# EAGLE design 2019_Dashboard_1-29-19 (EAGLE 9.1.0)
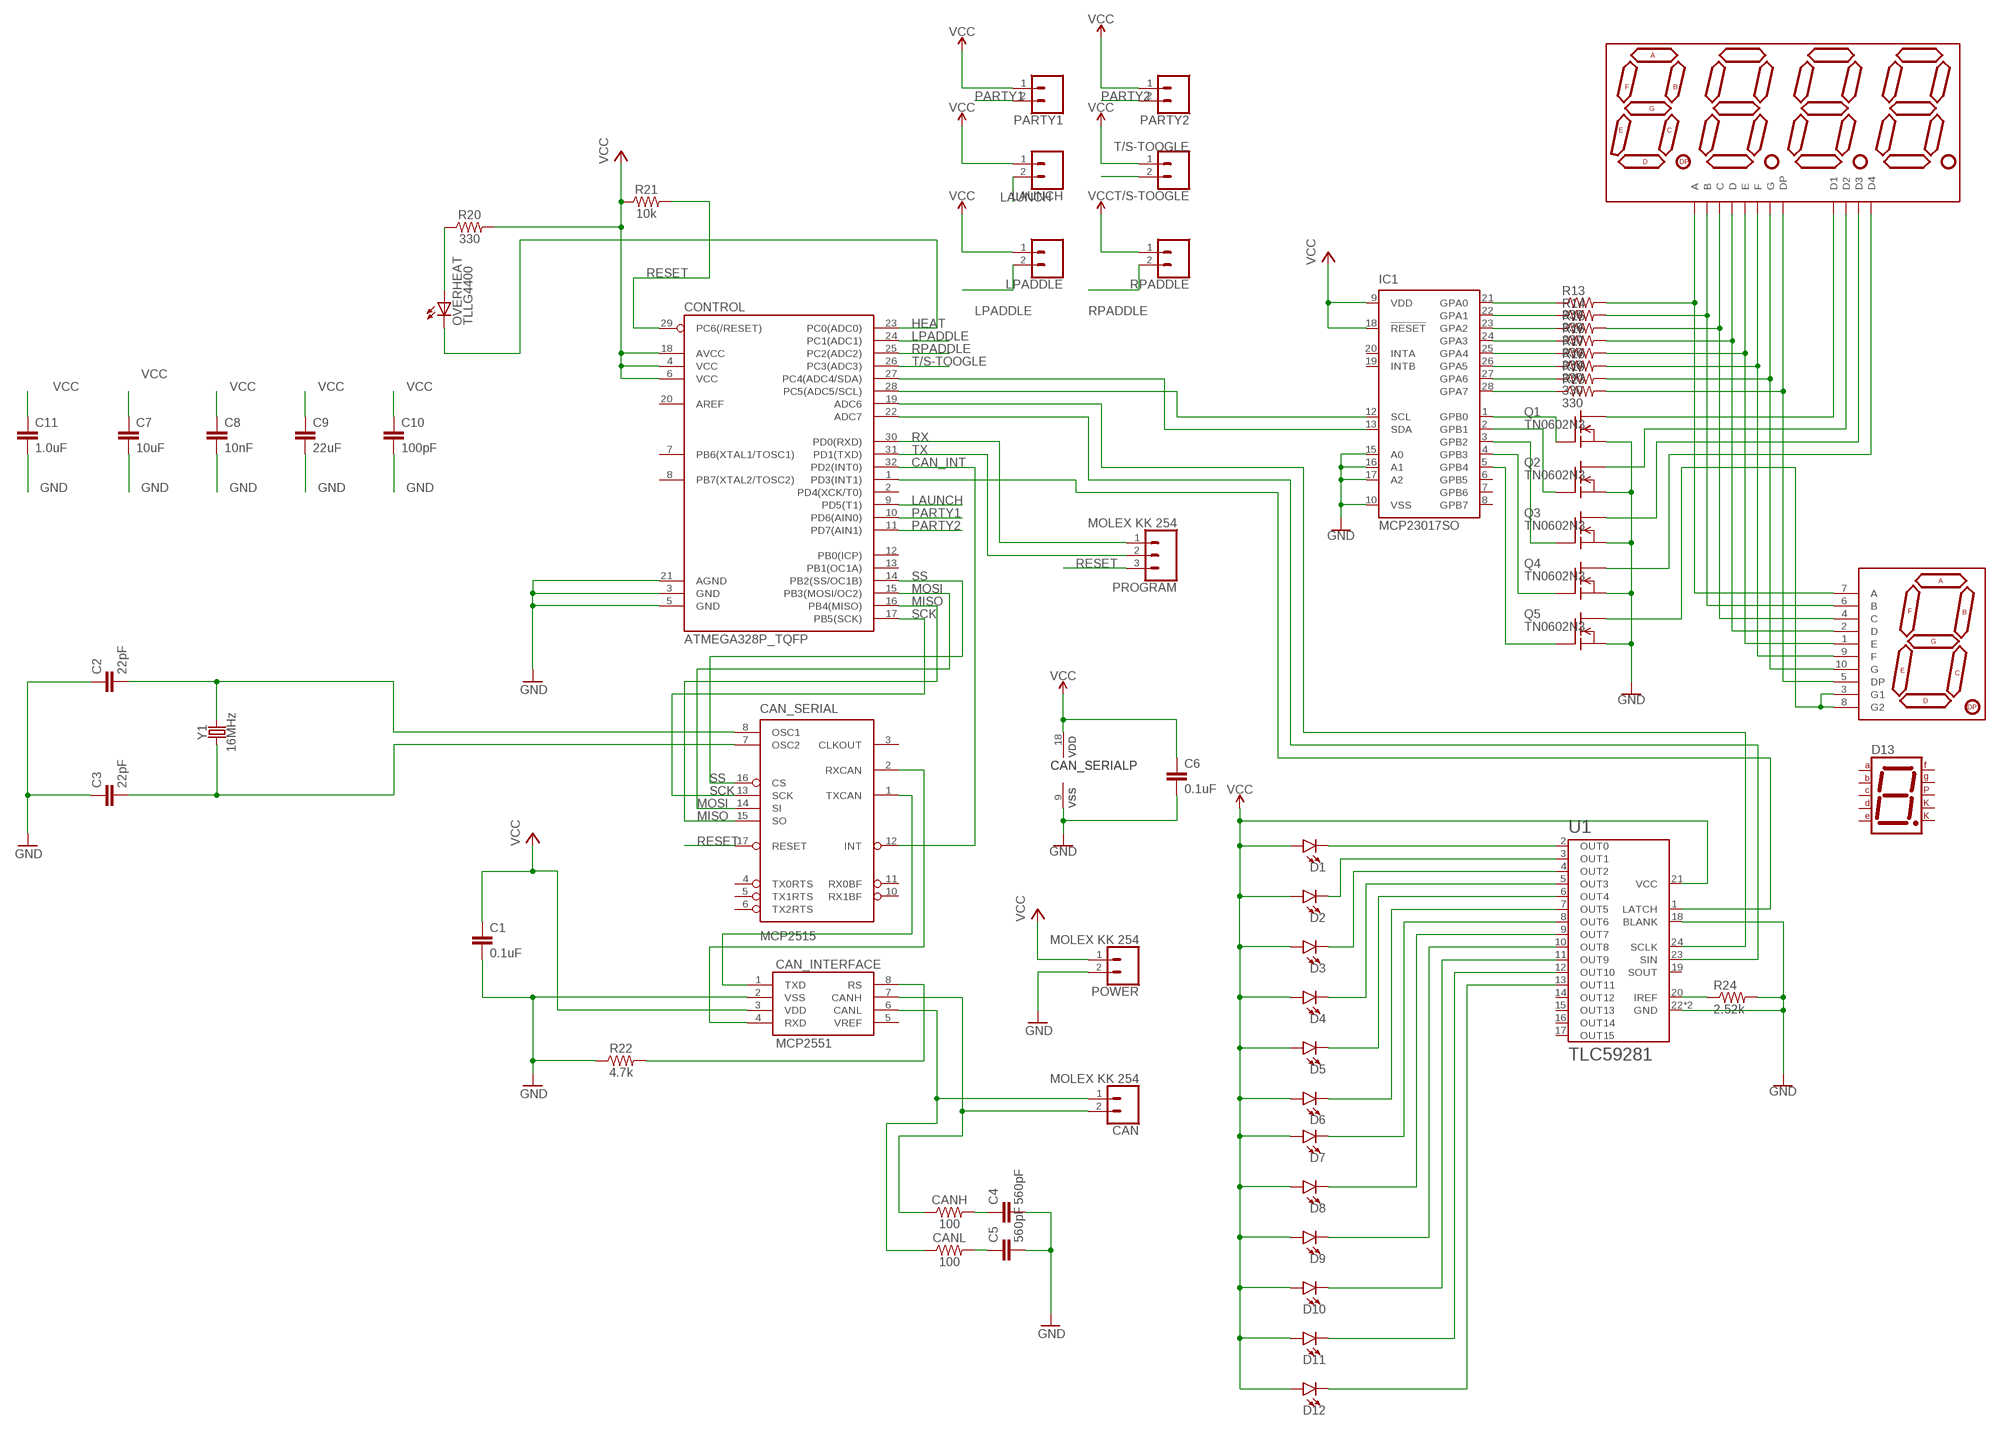
[diagram p0: schematic, sheet 1]

## Parts
C1  0.1uF  0.1UF-0603-25V-(+80/-20%)  [0603]
C2  22pF  22PF-0603-50V-5%  [0603]
C3  22pF  22PF-0603-50V-5%  [0603]
C4  560pF  560PF-0603-50V-5%  [0603]
C5  560pF  560PF-0603-50V-5%  [0603]
C6  0.1uF  0.1UF-0402-16V-10%  [0402]
C7  10uF  10UF-0805-10V-10%  [0805]
C8  10nF  10NF-0603-50V-10%  [0603]
C9  22uF  22UF-0805-6.3V-20%  [0805]
C10  100pF  100PF-0603-50V-5%  [0603]
C11  1.0uF  1.0UF-0805-25V-(+80/-20%)  [0805]
CAN  MOLEX KK 254  CONN_02  [1X02]
CAN_INTERFACE  MCP2551  [SO08]
CAN_SERIAL  MCP2515  MCP2515(MCP2510)SO  [SO18W]
CANH  100  100OHM-0603-1/4W-5%  [0603]
CANL  100  100OHM-0603-1/4W-5%  [0603]
CONTROL  ATMEGA328P_TQFP  [TQFP32-08]
D1  LED5MM  [LED_5MM]
D2  LED5MM  [LED_5MM]
D3  LED5MM  [LED_5MM]
D4  LED5MM  [LED_5MM]
D5  LED5MM  [LED_5MM]
D6  LED5MM  [LED_5MM]
D7  LED5MM  [LED_5MM]
D8  LED5MM  [LED_5MM]
D9  LED5MM  [LED_5MM]
D10  LED5MM  [LED_5MM]
D11  LED5MM  [LED_5MM]
D12  LED5MM  [LED_5MM]
D13  7SEG-CK  [7SEG-13]
DISP1  ATA8041ARBJ  7-SEGMENT-4DIGIT-20MM-RED  [7-SEGMENT-4DIGIT-20MM]
IC1  MCP23017SO  [SO28W]
LAUNCH  CONN_02LOCK  [1X02_LOCK]
LPADDLE  CONN_02LOCK  [1X02_LOCK]
OVERHEAT  TLLG4400  [LED3MM]
PARTY1  CONN_02LOCK  [1X02_LOCK]
PARTY2  CONN_02LOCK  [1X02_LOCK]
POWER  MOLEX KK 254  CONN_02  [1X02]
PROGRAM  MOLEX KK 254  CONN_03  [1X03]
Q1  TN0602N3  [TO-92]
Q2  TN0602N3  [TO-92]
Q3  TN0602N3  [TO-92]
Q4  TN0602N3  [TO-92]
Q5  TN0602N3  [TO-92]
R13  330  R-US_R0603  [R0603]
R14  330  R-US_R0603  [R0603]
R15  330  R-US_R0603  [R0603]
R16  330  R-US_R0603  [R0603]
R17  330  R-US_R0603  [R0603]
R18  330  R-US_R0603  [R0603]
R19  330  R-US_R0603  [R0603]
R20  330  330OHM-0603-1/10W-1%  [0603]
R21  10k  10KOHM-0603-1/10W-1%  [0603]
R22  4.7k  4.7KOHM-0603-1/10W-1%  [0603]
R23  330  R-US_R0603  [R0603]
R24  2.52k  R-US_R0603  [R0603]
RPADDLE  CONN_02LOCK  [1X02_LOCK]
T/S-TOOGLE  CONN_02LOCK  [1X02_LOCK]
U1  TLC59281  [QFN-24]
U$1  YSD-1601AR4B-8  7-SEGMENT-1DIGIT-1INCH-RED  [7-SEGMENT-1"PTH]
Y1  16MHz  CRYSTAL-16MHZPTH-HC49US  [HC49US]

## Nets
CAN_INT: CAN_SERIAL.12(INT) CONTROL.32(PD2(INT0))
CANH: CAN.2 CAN_INTERFACE.7(CANH) CANH.1
CANL: CAN.1 CAN_INTERFACE.6(CANL) CANL.1
CHI: C4.1 CANH.2
CI_SLOPE: CAN_INTERFACE.8(RS) R22.2
CLI: C5.1 CANL.2
GND [power]: C1.2 C2.1 C3.1 C4.2 C5.2 C6.2 C7.2 C8.2 C9.2 C10.2 C11.2 CAN_INTERFACE.2(VSS) CAN_SERIAL.9(VSS) CONTROL.3(GND) CONTROL.5(GND) CONTROL.21(AGND) IC1.10(VSS) IC1.15(A0) IC1.16(A1) IC1.17(A2) POWER.2 Q1.1(S) Q2.1(S) Q3.1(S) Q4.1(S) Q5.1(S) R22.1 R24.2 U1.18(BLANK) U1.22(GND) U1.EP(GND)
HEAT: CONTROL.23(PC0(ADC0)) OVERHEAT.K(C)
HEAT+: OVERHEAT.A R20.1
LAUNCH: CONTROL.9(PD5(T1)) LAUNCH.2
LPADDLE: CONTROL.24(PC1(ADC1)) LPADDLE.2
MISO: CAN_SERIAL.15(SO) CONTROL.16(PB4(MISO))
MOSI: CAN_SERIAL.14(SI) CONTROL.15(PB3(MOSI/OC2))
N$1: CONTROL.28(PC5(ADC5/SCL)) IC1.12(SCL)
N$2: CONTROL.27(PC4(ADC4/SDA)) IC1.13(SDA)
N$3 [led]: DISP1.11(A) R13.2 U$1.7(A)
N$4 [led]: DISP1.7(B) R14.2 U$1.6(B)
N$5 [led]: DISP1.4(C) R15.2 U$1.4(C)
N$6 [led]: DISP1.2(D) R16.2 U$1.2(D)
N$7 [led]: DISP1.1(E) R17.2 U$1.1(E)
N$8 [led]: DISP1.10(F) R18.2 U$1.9(F)
N$9 [led]: DISP1.5(G) R19.2 U$1.10(G)
N$10 [led]: DISP1.3(DP) R23.2 U$1.5(DP)
N$11 [led]: DISP1.12(D1) Q1.3(D)
N$12 [led]: DISP1.9(D2) Q2.3(D)
N$13 [led]: DISP1.8(D3) Q3.3(D)
N$14 [led]: DISP1.6(D4) Q4.3(D)
N$15 [led]: Q5.3(D) U$1.3(G1) U$1.8(G2)
N$18: CONTROL.19(ADC6) U1.24(SCLK)
N$19: CONTROL.22(ADC7) U1.23(SIN)
N$20: CONTROL.1(PD3(INT1)) U1.1(LATCH)
N$28: IC1.21(GPA0) R13.1
N$29: IC1.22(GPA1) R14.1
N$30: IC1.23(GPA2) R15.1
N$31: IC1.24(GPA3) R16.1
N$32: IC1.25(GPA4) R17.1
N$33: IC1.26(GPA5) R18.1
N$46: IC1.27(GPA6) R19.1
N$47: IC1.28(GPA7) R23.1
N$48: IC1.1(GPB0) Q1.2(G)
N$49: IC1.2(GPB1) Q2.2(G)
N$50: IC1.3(GPB2) Q3.2(G)
N$51: IC1.4(GPB3) Q4.2(G)
N$52: IC1.5(GPB4) Q5.2(G)
N$53: D1.K(C) U1.2(OUT0)
N$54: D2.K(C) U1.3(OUT1)
N$55: D3.K(C) U1.4(OUT2)
N$56: D4.K(C) U1.5(OUT3)
N$57: CAN_INTERFACE.1(TXD) CAN_SERIAL.1(TXCAN)
N$58: CAN_INTERFACE.4(RXD) CAN_SERIAL.2(RXCAN)
N$59: D5.K(C) U1.6(OUT4)
N$60: D6.K(C) U1.7(OUT5)
N$61: D7.K(C) U1.8(OUT6)
N$62: D8.K(C) U1.9(OUT7)
N$63: D9.K(C) U1.10(OUT8)
N$64: D10.K(C) U1.11(OUT9)
N$65: D11.K(C) U1.12(OUT10)
N$66: D12.K(C) U1.13(OUT11)
N$67: R24.1 U1.20(IREF)
OSC1: C2.2 CAN_SERIAL.8(OSC1) Y1.2
OSC2: C3.2 CAN_SERIAL.7(OSC2) Y1.1
PARTY1: CONTROL.10(PD6(AIN0)) PARTY1.2
PARTY2: CONTROL.11(PD7(AIN1)) PARTY2.2
RESET: CAN_SERIAL.17(RESET) CONTROL.29(PC6(/RESET)) PROGRAM.3 R21.2
RPADDLE: CONTROL.25(PC2(ADC2)) RPADDLE.2
RX: CONTROL.30(PD0(RXD)) PROGRAM.1
SCK: CAN_SERIAL.13(SCK) CONTROL.17(PB5(SCK))
SS: CAN_SERIAL.16(CS) CONTROL.14(PB2(SS/OC1B))
T/S-TOOGLE: CONTROL.26(PC3(ADC3)) T/S-TOOGLE.2
TX: CONTROL.31(PD1(TXD)) PROGRAM.2
VCC [power]: C1.1 C6.1 C7.1 C8.1 C9.1 C10.1 C11.1 CAN_INTERFACE.3(VDD) CAN_SERIAL.18(VDD) CONTROL.4(VCC) CONTROL.6(VCC) CONTROL.18(AVCC) D1.A D2.A D3.A D4.A D5.A D6.A D7.A D8.A D9.A D10.A D11.A D12.A IC1.9(VDD) IC1.18(!RESET) LAUNCH.1 LPADDLE.1 PARTY1.1 PARTY2.1 POWER.1 R20.2 R21.1 RPADDLE.1 T/S-TOOGLE.1 U1.21(VCC)
Unconnected: CAN_INTERFACE.5(VREF) CAN_SERIAL.3(CLKOUT) CAN_SERIAL.4(TX0RTS) CAN_SERIAL.5(TX1RTS) CAN_SERIAL.6(TX2RTS) CAN_SERIAL.10(RX1BF) CAN_SERIAL.11(RX0BF) CONTROL.2(PD4(XCK/T0)) CONTROL.7(PB6(XTAL1/TOSC1)) CONTROL.8(PB7(XTAL2/TOSC2)) CONTROL.12(PB0(ICP)) CONTROL.13(PB1(OC1A)) CONTROL.20(AREF) D13.1(E) D13.2(D) D13.3(CK1) D13.4(C) D13.5(DP) D13.6(B) D13.7(A) D13.8(CK2) D13.9(F) D13.10(G) IC1.6(GPB5) IC1.7(GPB6) IC1.8(GPB7) IC1.19(INTB) IC1.20(INTA) U1.14(OUT12) U1.15(OUT13) U1.16(OUT14) U1.17(OUT15) U1.19(SOUT)

## Library data of the parts
C1 = SparkFun-Capacitors:0.1UF: 0.1µF ceramic capacitors A capacitor is a passive two-terminal electrical component used to store electrical energy temporarily in an electric field.; PROD_ID: CAP-00810
C2 C3 = SparkFun-Capacitors:22PF: 22pF ceramic capacitors A capacitor is a passive two-terminal electrical component used to store electrical energy temporarily in an electric field.; PROD_ID: CAP-07876
C4 C5 = SparkFun-Capacitors:560PF: 0.56nF/560pF ceramic capacitors A capacitor is a passive two-terminal electrical component used to store electrical energy temporarily in an electric field.; PROD_ID: CAP-08749
C6 = SparkFun-Capacitors:0.1UF: 0.1µF ceramic capacitors A capacitor is a passive two-terminal electrical component used to store electrical energy temporarily in an electric field.; PROD_ID: CAP-12416
C7 = SparkFun-Capacitors:10UF: 10.0µF ceramic capacitors A capacitor is a passive two-terminal electrical component used to store electrical energy temporarily in an electric field.; PROD_ID: CAP-11330
C8 = SparkFun-Capacitors:10NF: 0.01uF/10nF/10,000pF ceramic capacitors A capacitor is a passive two-terminal electrical component used to store electrical energy temporarily in an electric field. CAP-09321; PROD_ID: CAP-00867
C9 = SparkFun-Capacitors:22UF: 22µF ceramic capacitors A capacitor is a passive two-terminal electrical component used to store electrical energy temporarily in an electric field.; PROD_ID: CAP-08402
C10 = SparkFun-Capacitors:100PF: 100pF/0.1nF ceramic capacitors A capacitor is a passive two-terminal electrical component used to store electrical energy temporarily in an electric field.; PROD_ID: CAP-07883
C11 = SparkFun-Capacitors:1.0UF: 1µF ceramic capacitors A capacitor is a passive two-terminal electrical component used to store electrical energy temporarily in an electric field.; PROD_ID: CAP-11625
CAN LAUNCH LPADDLE PARTY1 PARTY2 POWER RPADDLE T/S-TOOGLE = SparkFun-Connectors:CONN_02: Multi connection point. Often used as Generic Header-pin footprint for 0.1 inch spaced/style header connections On any of the 0.1 inch spaced packages, you can populate with these: Break Away Headers - Straight <https://www.sparkfun.com/products/116> (PRT-00116) Break Away Male Headers - Right Angle <https://www.sparkfun.com/products/553> (PRT-00553) Female Headers <https://www.sparkfun.com/products/115> (PRT-00115) Break Away Headers - Machine Pin <https://www.sparkfun.com/products/117> (PRT-00117) Break Away Female Headers - Swiss Machine Pin <https://www.sparkfun.com/products/743> (PRT-00743) For SCREWTERMINALS and SPRING TERMINALS visit here: Screw Terimnals on SparkFun.com <https://www.sparkfun.com/search/results?term=Screw+Terminals> (5mm/3.5mm/2.54mm spacing) This device is also useful as a general connection point to wire up your design to another part of your project. Our various solder wires solder well into these plated through hole pads. Hook-Up Wire - Assortment (Stranded, 22 AWG) <https://www.sparkfun.com/products/11375> (PRT-11375) Hook-Up Wire - Assortment (Solid Core, 22 AWG) <https://www.sparkfun.com/products/11367> (PRT-11367) View the entire wire category on our website here <https://www.sparkfun.com/categories/141> Special notes: Molex polarized connector foot print use with: PRT-08233 with associated crimp pins and housings. 2.54_SCREWTERM for use with PRT-10571. 3.5mm Screw Terminal footprints for PRT-08084 5mm Screw Terminal footprints for use with PRT-08432
CAN_INTERFACE = SparkFun-IC-Comms:MCP2551: MCP2551 High Speed CAN Transceiver High speed CAN transceiver Datasheet <http://www.sparkfun.com/datasheets/DevTools/Arduino/MCP2551.pdf> SparkFun Products CAN-BUS Shield <https://www.sparkfun.com/products/13262> (DEV-13262) SparkFun OBD-II UART <https://www.sparkfun.com/products/9555> (WIG-09555); PROD_ID: IC-09907
CAN_SERIAL = SparkFun-IC-Comms:MCP2515(MCP2510): CAN controller with SPI interface The MCP2515 controller supercedes the MCP2510 while addressing all errata associated with it. The two devices are pin compatible, either can be used with this device. 18-pin package SOIC Simple SPI interface to any MCU. One-shot mode ensures message transmission is attempted only once Databyte filtering Start-of-Frame (SOF) output Low-power CMOS Technology Datasheet <http://www.sparkfun.com/datasheets/DevTools/Arduino/MCP2515.pdf> SparkFun Products CAN-BUS Shield <https://www.sparkfun.com/products/13262> (DEV-13262); PROD_ID: IC-09906
CANH CANL = SparkFun-Resistors:100OHM: 100Ω resistor A resistor is a passive two-terminal electrical component that implements electrical resistance as a circuit element. Resistors act to reduce current flow, and, at the same time, act to lower voltage levels within circuits. - Wikipedia; PROD_ID: RES-12438
CONTROL = SparkFun-IC-Microcontroller:ATMEGA328P_TQFP: Popular 328P in QFP Storefront component: ATmega328 - TQFP <https://www.sparkfun.com/products/13448> (COM-13448) Datasheet <http://www.sparkfun.com/datasheets/Components/SMD/ATMega328.pdf> SparkFun Products SparkFun RedBoard - Programmed with Arduino <https://www.sparkfun.com/products/12757> (DEV-12757) Arduino Pro Mini 328 - 5V/16MHz <https://www.sparkfun.com/products/11113> (DEV-11113) Arduino Pro Mini 328 - 3.3V/8MHz <https://www.sparkfun.com/products/11114> (DEV-11114) SparkFun OpenLog <https://www.sparkfun.com/products/13712> (DEV-13712) SparkFun MicroView - OLED Arduino Module <https://www.sparkfun.com/products/12923> (DEV-12923) SparkFun Digital Sandbox <https://www.sparkfun.com/products/12651> (DEV-12651) SparkFun PicoBoard <https://www.sparkfun.com/products/11888> (WIG-11888) Arduino Fio <https://www.sparkfun.com/products/10116> (DEV-10116) LilyPad Arduino 328 Main Board <https://www.sparkfun.com/products/13342> (DEV-13342) SparkFun RedStick <https://www.sparkfun.com/products/13741> (DEV-13741) LilyPad MP3 <https://www.sparkfun.com/products/11013> (DEV-11013) LilyPad Arduino SimpleSnap <https://www.sparkfun.com/products/10941> (DEV-10941) SparkFun Stepoko <https://www.sparkfun.com/products/13899> (ROB-13899) SparkFun Geiger Counter <https://www.sparkfun.com/products/11345> (SEN-11345) SparkFun EL Sequencer <https://www.sparkfun.com/products/12781> (COM-12781) Arduino Pro 328 - 5V/16MHz <https://www.sparkfun.com/products/10915> (DEV-10915) CryptoCape <https://www.sparkfun.com/products/12773> (DEV-12773) SparkFun IR Thermometer Evaluation Board - MLX90614 <https://www.sparkfun.com/products/10740> (SEN-10740) SparkFun RedBot Mainboard <https://www.sparkfun.com/products/12097> (ROB-12097) Arduino Pro 328 - 3.3V/8MHz <https://www.sparkfun.com/products/10914> (DEV-10914) SparkFun Block for Intel® Edison - Arduino <https://www.sparkfun.com/products/13036> (DEV-13036) SparkFun Simon Says - Surface Mount Soldering Kit <https://www.sparkfun.com/products/10935> (KIT-10935) SparkFun 7-Segment Serial Display - Red <https://www.sparkfun.com/products/11441> (COM-11441) SparkFun 7-Segment Serial Display - White <https://www.sparkfun.com/products/11629> (COM-11629) SparkFun 7-Segment Serial Display - Yellow <https://www.sparkfun.com/products/11443> (COM-11443) SparkFun 7-Segment Serial Display - Kelly Green <https://www.sparkfun.com/products/11440> (COM-11440) SparkFun 7-Segment Serial Display - Blue <https://www.sparkfun.com/products/11442> (COM-11442) SparkFun OpenSegment Serial Display - 20mm (Blue) <https://www.sparkfun.com/products/11647> (COM-11647) SparkFun OpenSegment Serial Display - 20mm (Green) <https://www.sparkfun.com/products/11646> (COM-11646) SparkFun OpenSegment Serial Display - 20mm (White) <https://www.sparkfun.com/products/11648> (COM-11648) SparkFun OpenSegment Serial Display - 20mm (Red) <https://www.sparkfun.com/products/11644> (COM-11644) SparkFun OpenSegment Serial Display - 20mm (Yellow) <https://www.sparkfun.com/products/11645> (COM-11645) SparkFun OpenSegment Shield <https://www.sparkfun.com/products/13190> (DEV-13190); PROD_ID: IC-09069
D1-D12 = SparkFun-LED:LED: LED (Generic) Standard schematic elements and footprints for 5mm, 3mm, 1206, and 0603 sized LEDs. Generic LEDs with no color specified.
D13 = special:7SEG-CK: 7-segment DISPLAY single cathode, 13 mm
DISP1 = SparkFun-LED:7-SEGMENT-4DIGIT-20MM: 4 Digit 7 Segment Display This is a part for the 4-Digit 7-segment LEDs from Young Sun. Different from the Digikey LEDs, all 16 pins are used. The LONGPADS Variant is used for a test jig, but you may like it because there is more pad to solder to. If you are concerned about routing space, the standard works just fine though. Datasheets: Red <http://cdn.sparkfun.com/datasheets/Components/LED/1LEDREDCC.pdf> Yellow <http://cdn.sparkfun.com/datasheets/Components/LED/1LEDYELCC.pdf> Green <http://cdn.sparkfun.com/datasheets/Components/LED/1LEDGRNCC.pdf> Blue <http://cdn.sparkfun.com/datasheets/Components/LED/1LEDBLUCC.pdf> White <http://cdn.sparkfun.com/datasheets/Components/LED/1LEDWHTCC.pdf> SparkFun Products Raw Components 7-Segment Display - 20mm (Red) <https://www.sparkfun.com/products/11405> (COM-11405) 7-Segment Display - 20mm (Yellow) <https://www.sparkfun.com/products/11406> (COM-11406) 7-Segment Display - 20mm (Green) <https://www.sparkfun.com/products/11407> (COM-11407) 7-Segment Display - 20mm (Blue) <https://www.sparkfun.com/products/11408> (COM-11408) 7-Segment Display - 20mm (White) <https://www.sparkfun.com/products/11409> (COM-11409) Serial Controlled SparkFun OpenSegment Serial Display - 20mm (Red) <https://www.sparkfun.com/products/11644> (COM-11644) SparkFun OpenSegment Serial Display - 20mm (Yellow) <https://www.sparkfun.com/products/11645> (COM-11645) SparkFun OpenSegment Serial Display - 20mm (Green) <https://www.sparkfun.com/products/11646> (COM-11646) SparkFun OpenSegment Serial Display - 20mm (Blue) <https://www.sparkfun.com/products/11647> (COM-11647) SparkFun OpenSegment Serial Display - 20mm (White) <https://www.sparkfun.com/products/11648> (COM-11648) Other SparkFun OpenSegment Shield <https://www.sparkfun.com/products/13190> (DEV-13190); PROD_ID: COMP-11449
IC1 = adafruit:MCP23017: http://ww1.microchip.com/downloads/en/DeviceDoc/21952a.pdf Source: http://ww1.microchip.com/downloads/en/DeviceDoc/21952a.pdf
OVERHEAT = led:TLLG4400: Low Current (2mA) LED 3 mm Tinted Diffused Package color GREEN Source: Data sheet <http://www.farnell.com/datasheets/391098.pdf>; MF: VISHAY SEMICONDUCTOR; OC_FARNELL: 1612435
PROGRAM = SparkFun-Connectors:CONN_03: Multi connection point. Often used as Generic Header-pin footprint for 0.1 inch spaced/style header connections On any of the 0.1 inch spaced packages, you can populate with these: Break Away Headers - Straight <https://www.sparkfun.com/products/116> (PRT-00116) Break Away Male Headers - Right Angle <https://www.sparkfun.com/products/553> (PRT-00553) Female Headers <https://www.sparkfun.com/products/115> (PRT-00115) Break Away Headers - Machine Pin <https://www.sparkfun.com/products/117> (PRT-00117) Break Away Female Headers - Swiss Machine Pin <https://www.sparkfun.com/products/743> (PRT-00743) Stackable Header - 3 Pin (Female, 0.1") <https://www.sparkfun.com/products/13875> (PRT-13875) For SCREWTERMINALS and SPRING TERMINALS visit here: Screw Terimnals on SparkFun.com <https://www.sparkfun.com/search/results?term=Screw+Terminals> (5mm/3.5mm/2.54mm spacing) This device is also useful as a general connection point to wire up your design to another part of your project. Our various solder wires solder well into these plated through hole pads. Hook-Up Wire - Assortment (Stranded, 22 AWG) <https://www.sparkfun.com/products/11375> (PRT-11375) Hook-Up Wire - Assortment (Solid Core, 22 AWG) <https://www.sparkfun.com/products/11367> (PRT-11367) View the entire wire category on our website here <https://www.sparkfun.com/categories/141> Special notes: Molex polarized connector foot print use with SKU : PRT-08232 with associated crimp pins and housings.
Q1-Q5 = transistor-fet:TN0602N3: N-Channel Enhancement MOSFET 20V; 4A; 0,75Ohm
R13-R19 R23 R24 = resistor:R-US_: RESISTOR, American symbol
R20 = SparkFun-Resistors:330OHM: 330Ω resistor A resistor is a passive two-terminal electrical component that implements electrical resistance as a circuit element. Resistors act to reduce current flow, and, at the same time, act to lower voltage levels within circuits. - Wikipedia; PROD_ID: RES-00818
R21 = SparkFun-Resistors:10KOHM: 10kΩ resistor A resistor is a passive two-terminal electrical component that implements electrical resistance as a circuit element. Resistors act to reduce current flow, and, at the same time, act to lower voltage levels within circuits. - Wikipedia; PROD_ID: RES-00824
R22 = SparkFun-Resistors:4.7KOHM: 4.7kΩ resistor A resistor is a passive two-terminal electrical component that implements electrical resistance as a circuit element. Resistors act to reduce current flow, and, at the same time, act to lower voltage levels within circuits. - Wikipedia; PROD_ID: RES-07857
U1 = TLC59281:TLC59281; AVAILABILITY: Unavailable; DESCRIPTION: 16-Channel Constant-Current LED Driver without LED Open Detection; MF: Texas Instruments; MP: TLC59281; PACKAGE: None; PRICE: None
U$1 = SparkFun-LED:7-SEGMENT-1DIGIT-1INCH: 7-Segment Display, single digit, 1" EZ is for kits. Pads are only exposed on the bottom side to help prevent soldering in upside down. Datasheet (Red) <https://cdn.sparkfun.com/datasheets/Components/LED/YSD-160AR4B-8.pdf> Datasheet (Blue) <https://cdn.sparkfun.com/datasheets/Components/LED/YSD-160AB3C-8.pdf> SparkFun Products 7-Segment Display - LED (Red) <https://www.sparkfun.com/products/8546> (COM-08546) 7-Segment Display - LED (Blue) <https://www.sparkfun.com/products/9191> (COM-09191); PROD_ID: COMP-08615
Y1 = SparkFun-Clocks:CRYSTAL-16MHZ: 16MHz Crystal Digikey Example <http://www.digikey.com/product-search/en?keywords=535-9122-1-ND> Frequency: 16MHz Frequency Stability: ±50ppm Frequency Tolerance: ±20ppm Load Capacitance: 18pF SparkFun Products: Pro Micro -5V/16MHz <https://www.sparkfun.com/products/12640> SparkFun Serial Enabled LCD Kit <https://www.sparkfun.com/products/10097>; PROD_ID: XTAL-08181; SF_ID: COM-00536

## Net classes
1 power: width 0.406 mm
2 led: width 0.203 mm

## Board
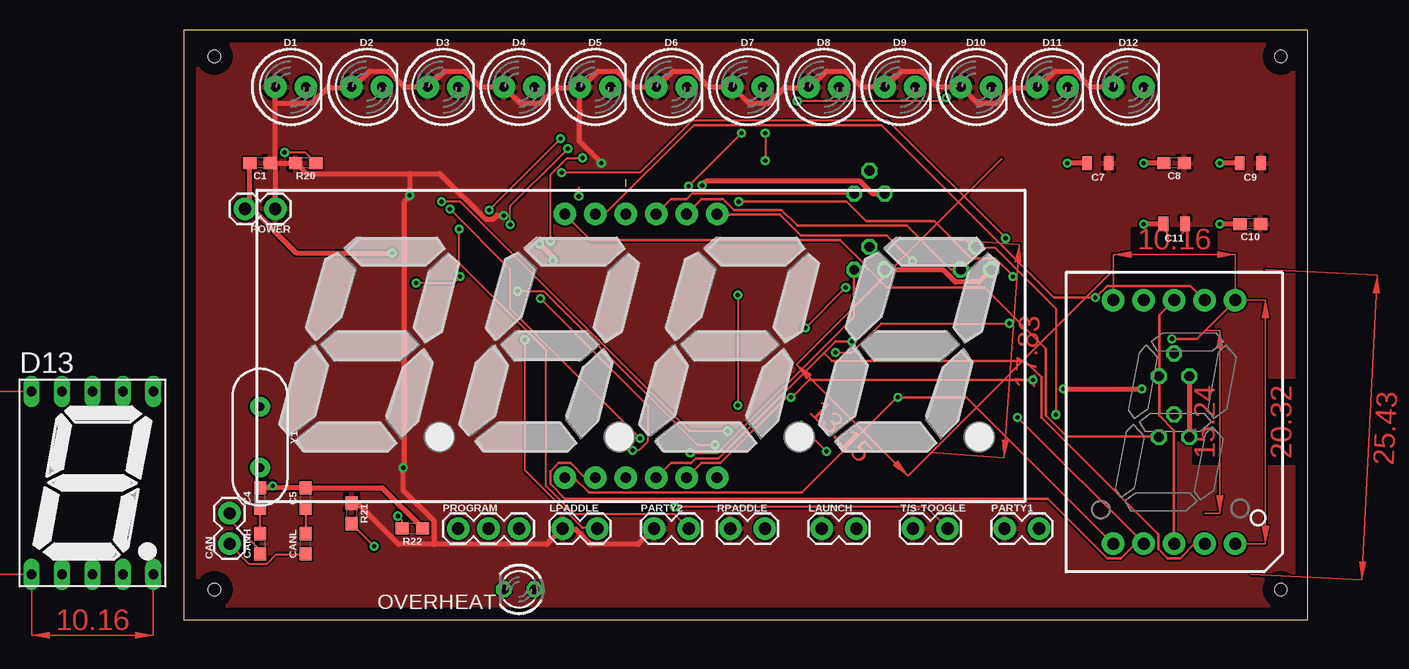
[diagram p1: board, top side]
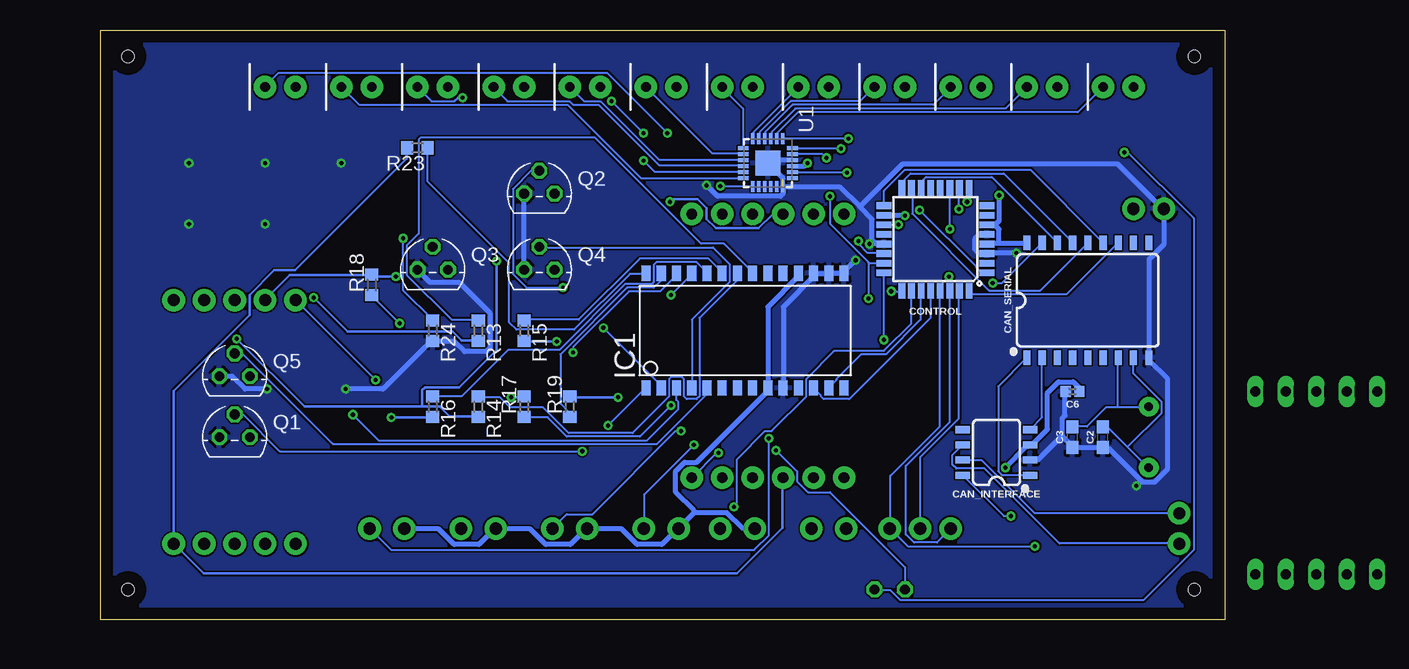
[diagram p2: board, bottom side, seen from below]

Size 93.71 x 49.2 mm. Coordinates in mm from the lower left corner, seen from the top.
Outline: 0,0 93.71,0 93.71,49.2 0,49.2 0,0
Copper layers (1*16): Top 0.035mm / dielectric 1.5mm / Bottom 0.035mm
Design rules "default": minimum track width 6mil, minimum drill 0.35mm, track to track 6mil, track to pad 6mil, pad to pad 6mil, via to via 6mil, smd to smd 6mil, copper to edge 40mil, drill to drill 6mil, minimum pad ring 10mil, minimum via ring 8mil, stop-mask expansion 4mil, vias tented up to drill 0mil, thermal gap 10mil
Holes 1 mm at 91.44,46.99 2.54,2.54 2.54,46.99 91.44,2.54

### Footprints (pad centres in the part's own frame; a part is rotated, then mirrored left to right if it is on the bottom)
0603 = smd 1.1 x 1: 1 -0.85,0; 2 0.85,0
0402 = smd 0.85 x 0.9: 1 -0.58,0; 2 0.58,0
0805 = smd 0.8 x 1.2: 1 -0.9,0; 2 0.9,0
1X02 = drill 1.016 pad 1.88: 1 0,0; 2 2.54,0
SO08 = smd 0.6 x 1.2: 1 -1.905,-2.8; 2 -0.635,-2.8; 3 0.635,-2.8; 4 1.905,-2.8; 5 1.905,2.8; 6 0.635,2.8; 7 -0.635,2.8; 8 -1.905,2.8
SO18W = smd 0.6 x 1.2: 1 -5.08,-4.788; 2 -3.81,-4.788; 3 -2.54,-4.788; 4 -1.27,-4.788; 5 0,-4.788; 6 1.27,-4.788; 7 2.54,-4.788; 8 3.81,-4.788; 9 5.08,-4.788; 10 5.08,4.788; 11 3.81,4.788; 12 2.54,4.788; 13 1.27,4.788; 14 0,4.788; 15 -1.27,4.788; 16 -2.54,4.788; 17 -3.81,4.788; 18 -5.08,4.788
TQFP32-08 = smd 1.27 x 0.559: 1 -4.293,2.8; 2 -4.293,2; 3 -4.293,1.2; 4 -4.293,0.4; 5 -4.293,-0.4; 6 -4.293,-1.2; 7 -4.293,-2; 8 -4.293,-2.8; 17 4.293,-2.8; 18 4.293,-2; 19 4.293,-1.2; 20 4.293,-0.4; 21 4.293,0.4; 22 4.293,1.2; 23 4.293,2; 24 4.293,2.8 | smd 0.559 x 1.27: 9 -2.8,-4.293; 10 -2,-4.293; 11 -1.2,-4.293; 12 -0.4,-4.293; 13 0.4,-4.293; 14 1.2,-4.293; 15 2,-4.293; 16 2.8,-4.293; 25 2.8,4.293; 26 2,4.293; 27 1.2,4.293; 28 0.4,4.293; 29 -0.4,4.293; 30 -1.2,4.293; 31 -2,4.293; 32 -2.8,4.293
LED_5MM = drill 0.813 pad 1.88: A -1.27,0; K 1.27,0
7SEG-13 = drill 0.813 long: 1 -5.08,-7.62; 2 -2.54,-7.62; 3 0,-7.62; 4 2.54,-7.62; 5 5.08,-7.62; 6 5.08,7.62; 7 2.54,7.62; 8 0,7.62; 9 -2.54,7.62; 10 -5.08,7.62
7-SEGMENT-4DIGIT-20MM = drill 0.9 pad 1.88: 1 -6.35,-10.998; 2 -3.81,-10.998; 3 -1.27,-10.998; 4 1.27,-10.998; 5 3.81,-10.998; 6 6.35,-10.998; 7 6.35,10.998; 8 3.81,10.998; 9 1.27,10.998; 10 -1.27,10.998; 11 -3.81,10.998; 12 -6.35,10.998
SO28W = smd 0.762 x 1.27: 1 -7.62,-4.78; 2 -6.35,-4.78; 3 -5.08,-4.78; 4 -3.81,-4.78; 5 -2.54,-4.78; 6 -1.27,-4.78; 7 0,-4.78; 8 1.27,-4.78; 9 2.54,-4.78; 10 3.81,-4.78; 11 5.08,-4.78; 12 6.35,-4.78; 13 7.62,-4.78; 14 8.89,-4.78; 15 8.89,4.78; 16 7.62,4.78; 17 6.35,4.78; 18 5.08,4.78; 19 3.81,4.78; 20 2.54,4.78; 21 1.27,4.78; 22 0,4.78; 23 -1.27,4.78; 24 -2.54,4.78; 25 -3.81,4.78; 26 -5.08,4.78; 27 -6.35,4.78; 28 -7.62,4.78
1X02_LOCK = drill 1.016 pad 1.88: 1 -0.178,0; 2 2.718,0
LED3MM = drill 0.813 octagon: A -1.27,0; K 1.27,0
1X03 = drill 1.016 pad 1.88: 1 0,0; 2 2.54,0; 3 5.08,0
TO-92 = drill 0.813 octagon: 1 -1.27,0; 2 0,1.905; 3 1.27,0
R0603 = smd 1 x 1.1: 1 -0.85,0; 2 0.85,0
QFN-24 = smd 0.9 x 0.3: 1 -2.05,1.25; 2 -2.05,0.75; 3 -2.05,0.25; 4 -2.05,-0.25; 5 -2.05,-0.75; 6 -2.05,-1.25; 13 1.95,-1.25; 14 1.95,-0.75; 15 1.95,-0.25; 16 1.95,0.25; 17 1.95,0.75; 18 1.95,1.25 | smd 0.3 x 0.9: 7 -1.25,-2.05; 8 -0.75,-2.05; 9 -0.25,-2.05; 10 0.25,-2.05; 11 0.75,-2.05; 12 1.25,-2.05; 19 1.25,2.05; 20 0.75,2.05; 21 0.25,2.05; 22 -0.25,2.05; 23 -0.75,2.05; 24 -1.25,2.05 | smd 2.1 x 2.1: EP 0,0
7-SEGMENT-1"PTH = drill 1 pad 1.88: 1 -5.08,-10.16; 2 -2.54,-10.16; 3 0,-10.16; 4 2.54,-10.16; 5 5.08,-10.16; 6 5.08,10.16; 7 2.54,10.16; 8 0,10.16; 9 -2.54,10.16; 10 -5.08,10.16
HC49US = drill 0.7 pad 1.651: 1 -2.54,0; 2 2.54,0

### Placement (x,y rotation side)
C1  6.35,38.1 180 top
C2  10.16,15.24 90 bottom
C3  12.7,15.24 90 bottom
C4  6.35,10.16 90 top
C5  10.16,10.16 90 top
C6  12.7,19.05 180 bottom
C7  76.2,38.1 180 top
C8  82.55,38.1 180 top
C9  88.9,38.1 180 top
C10  88.9,33.02 180 top
C11  82.55,33.02 180 top
CAN  3.81,6.35 90 top
CAN_INTERFACE  19.05,13.97 90 bottom
CAN_SERIAL  11.43,26.67 0 bottom
CANH  6.35,6.35 90 top
CANL  10.16,6.35 90 top
CONTROL  24.13,31.75 180 bottom
D1  8.89,44.45 0 top
D2  15.24,44.45 0 top
D3  21.59,44.45 0 top
D4  27.94,44.45 0 top
D5  34.29,44.45 0 top
D6  40.64,44.45 0 top
D7  46.99,44.45 0 top
D8  53.34,44.45 0 top
D9  59.69,44.45 0 top
D10  66.04,44.45 0 top
D11  72.39,44.45 0 top
D12  78.74,44.45 0 top
D13  -7.62,11.43 0 top
DISP1  38.1,22.86 0 top
IC1  40.64,24.13 0 bottom
LAUNCH  53.34,7.62 0 top
LPADDLE  31.75,7.62 0 top
OVERHEAT  27.94,2.54 180 top
PARTY1  68.58,7.62 0 top
PARTY2  39.37,7.62 0 top
POWER  7.62,34.29 180 top
PROGRAM  22.86,7.62 0 top
Q1  82.55,15.24 0 bottom
Q2  57.15,35.56 0 bottom
Q3  66.04,29.21 0 bottom
Q4  57.15,29.21 0 bottom
Q5  82.55,20.32 0 bottom
R13  62.23,24.13 270 bottom
R14  62.23,17.78 270 bottom
R15  58.42,24.13 270 bottom
R16  66.04,17.78 270 bottom
R17  58.42,17.78 90 bottom
R18  71.12,27.94 90 bottom
R19  54.61,17.78 90 bottom
R20  10.16,38.1 180 top
R21  13.97,8.89 270 top
R22  19.05,7.62 180 top
R23  67.31,39.37 180 bottom
R24  66.04,24.13 270 bottom
RPADDLE  45.72,7.62 0 top
T/S-TOOGLE  60.96,7.62 0 top
U1  38.1,38.1 270 bottom
U$1  82.55,16.51 0 top
Y1  6.35,15.24 270 top

### Tracks (layer width: path | path; a pad name or v marks a point on that pad's centre or on a via)
CAN_INT
  Bottom 0.152: CAN_SERIAL.12 8.91,31.45 13.18,27.18 21.03,27.18 21.26,27.41 CONTROL.32
CANH
  Top 0.152: CAN.2 3.81,8.36 6.33,5.84 6.33,5.54 CANH.1
  Bottom 0.152: CAN.2 15.85,8.89 20.27,13.31 21.79,13.31 CAN_INTERFACE.7
CANL
  Top 0.152: CANL.1 10.13,5.46 7.7,5.46 6.93,4.7 5.41,4.7 3.81,6.3 CAN.1
  Bottom 0.152: CAN_INTERFACE.6 21.87,14.6 22.71,13.77 22.71,12.93 22.4,12.62 20.04,12.62 13.79,6.38 3.81,6.38 CAN.1
CHI
  Top 0.152: CANH.2 6.33,7.21 6.33,9.27 C4.1
CI_SLOPE  (via drill 0.35)
  Top 0.152: v17.83,8.66 18.14,8.36 18.14,7.67 R22.2
  Bottom 0.152: v17.83,8.66 18.44,8.66 21.79,12.01 CAN_INTERFACE.8
CLI
  Top 0.152: CANL.2 10.13,7.21 10.13,9.27 C5.1
GND  (via drill 0.35)  (1 unrouted)
  Top 0.406: Q5.1 Q1.1 | v73.3,19.25 v79.86,19.25 | Q4.1 58.45,29.16 63.32,29.16 64.31,28.17 66.29,28.17 67.28,29.16 Q3.1 | 7.39,11.02 10.13,11.02 C5.2 10.36,11.02 16.54,11.02 19.89,7.67 R22.1 | 7.39,11.02 6.4,11.02 C4.2 | C1.2 5.49,38.07 5.49,34.72 5.11,34.34 POWER.2 5.49,34.49 9.37,30.61 v17.37,30.61 | v30.78,30 30.78,30.23 v29.64,31.37 | v7.39,11.18 7.39,11.02 | Q2.1 57.38,35.56 56.31,36.63 43.59,36.63 v43.2,36.25 | C7.2 v73.66,38.1 | C8.2 v80.01,38.1 | C11.2 v80.01,33.02 | C10.2 v86.36,33.02 | C9.2 v86.36,38.1
  Bottom 0.406: Q4.1 58.45,29.23 58.45,35.56 Q2.1 | Q3.1 67.28,29.16 66.29,28.17 63.86,28.17 61.27,25.58 61.27,22.68 61.57,22.38 63.4,22.38 64.24,23.22 65.99,23.22 R24.2 66.22,23.22 70.18,19.25 v73.3,19.25 | Q5.1 82.75,20.32 81.69,19.25 v79.86,19.25 | IC1.10 36.81,19.41 36.81,26.11 34.21,28.7 IC1.17 34.29,28.85 33.22,28.85 IC1.16 33,28.93 31.78,28.93 IC1.15 31.7,29.08 v30.78,30 | 30.44,34.45 29.41,33.43 29.41,31.67 | 30.44,34.45 32.08,36.09 36.81,36.09 U1.18 36.81,35.94 36.81,35.56 37.03,35.33 42.29,35.33 v43.2,36.25 | 29.41,31.67 29.11,31.37 28.42,31.37 CONTROL.21 | 13.56,15.29 13.56,16.81 13.34,17.04 13.34,19.02 C6.2 | 13.56,15.29 12.73,14.45 C3.1 12.5,14.38 10.21,14.38 C2.1 9.98,14.3 9.68,14.3 6.97,11.59 | CAN_INTERFACE.2 16.23,13.39 15.55,13.39 13.72,15.21 13.56,15.29 | CONTROL.5 19.89,32.13 20.5,32.13 20.88,31.75 20.88,30.91 20.57,30.61 19.89,30.61 CONTROL.3 19.66,30.61 v17.37,30.61 | 6.97,11.59 6.86,11.48 5.87,11.48 4.8,12.55 4.8,20.17 6.33,21.69 CAN_SERIAL.9 6.33,21.92 6.33,30.07 5.11,31.29 5.11,34.27 POWER.2 5.26,34.34 8.91,38 26.9,38 30.44,34.45 | v29.64,31.37 29.49,31.52 29.41,31.67 | 6.97,11.59 v7.39,11.18 | U1.22 37.85,38.35 U1.EP 36.86,36.86 36.86,36.76
  pour Bottom: 0,49.53 0,0 93.98,0 93.98,49.53
HEAT  (via drill 0.35)
  Top 0.152: 32.92,36.09 v32.92,35.33 | v37.41,14.15 37.95,14.15 38.63,14.83 38.63,17.88 v29.72,26.8
  Bottom 0.152: 29.68,29.81 32.92,33.05 v32.92,35.33 | 29.68,29.81 29.64,29.77 28.42,29.77 CONTROL.23 | OVERHEAT.K 26.67,4.39 32.92,10.64 34.75,10.64 35.66,11.56 35.66,12.39 v37.41,14.15 | v29.72,26.8 29.72,29.77 29.68,29.81
HEAT+  (via drill 0.35)
  Top 0.152: 11.05,38.15 R20.1 10.97,38.15 10.13,38.99 v8.38,38.99
  Bottom 0.152: v8.38,38.99 8.08,38.99 2.59,33.5 2.59,5.84 6.78,1.65 27.05,1.65 27.89,2.49 29.19,2.49 OVERHEAT.A
LAUNCH  (via drill 0.35)
  Top 0.152: v21.49,34.87 23.01,34.87 42.14,15.75 v45.34,15.75
  Bottom 0.152: v21.49,34.87 21.34,35.03 21.34,36.02 CONTROL.9 | v45.34,15.75 45.8,15.75 52.73,8.81 54.86,8.81 LAUNCH.2
LPADDLE  (via drill 0.35)
  Top 0.152: v28.42,23.37 28.42,12.47 33.22,7.67 34.44,7.67 LPADDLE.2
  Bottom 0.152: v28.42,23.37 CONTROL.24
MISO
  Bottom 0.152: CAN_SERIAL.15 12.73,31.52 18.44,37.24 26.21,37.24 26.9,36.55 26.9,36.09 CONTROL.16
MOSI
  Bottom 0.152: CAN_SERIAL.14 11.43,31.45 15.39,27.48 19.66,27.48 26.06,33.88 26.06,36.02 CONTROL.15
N$1
  Bottom 0.152: IC1.12 34.29,19.33 33.68,18.72 33.68,18.64 33.45,18.41 31.32,18.41 24.54,25.2 24.54,27.41 CONTROL.28
N$2
  Bottom 0.152: IC1.13 33,19.41 32.39,20.02 32.39,20.09 30.33,22.15 28.27,22.15 25.38,25.04 25.38,27.41 CONTROL.27
N$3  (via drill 0.35)
  Top 0.203: U$1.7 83.9,27.86 76.96,27.86 v75.97,26.87 72.54,26.87 58.14,41.27 42.52,41.27 35.13,33.88 34.29,33.88 DISP1.11
  Bottom 0.203: v75.97,26.87 73.15,24.05 64.39,24.05 63.63,23.29 62.25,23.29 R13.2
N$4  (via drill 0.35)
  Top 0.203: v82.37,23.44 84.43,23.44 87.63,26.64 U$1.6 | v60.73,29.92 58.6,32.05 51.44,32.05 49.68,33.81 44.5,33.81 DISP1.7
  Bottom 0.203: 66.9,17.8 76.73,17.8 v82.37,23.44 | 66.9,17.8 65.46,17.8 64.62,16.97 62.25,16.97 R14.2 | v60.73,29.92 60.73,22.53 63.86,19.41 66.67,19.41 66.9,19.18 66.9,17.8
N$5  (via drill 0.35)
  Top 0.203: v55.7,23.22 54.33,23.22 53.38,22.26 | 53.38,22.26 44.58,13.46 42.67,13.46 42.29,13.08 40.61,13.08 39.39,11.86 DISP1.4 | 53.38,22.26 54.03,21.62 70.1,21.62 71.48,20.24 71.48,16.89 81.23,7.14 81.23,5.92 81.99,5.16 83.06,5.16 84.2,6.3 85.04,6.3 U$1.4
  Bottom 0.203: v55.7,23.22 58.37,23.22 R15.2
N$6  (via drill 0.35)
  Top 0.203: v69.49,16.89 80.01,6.38 U$1.2 79.63,6.68 78.11,5.16 76.96,5.16 72.01,10.11 31.78,10.11 30.56,11.33 30.56,12.39 31.24,13.08 32.23,13.08 33.45,11.86 DISP1.2
  Bottom 0.203: v69.49,16.89 66.06,16.89 R16.2
N$7  (via drill 0.35)
  Top 0.203: U$1.1 77.42,6.38 65.23,18.57 v59.51,18.57 59.44,18.57 51.51,10.64 33.76,10.64 32.54,11.86 DISP1.1
  Bottom 0.203: v59.51,18.57 58.45,18.57 R17.2
N$8  (via drill 0.35)
  Top 0.203: v46.25,34.87 55.25,34.87 56.84,33.27 62.56,33.27 65.68,30.15 67.67,30.15 69.11,28.7 v69.11,28.63
  Bottom 0.203: U$1.9 80.01,26.72 77.95,28.78 71.17,28.78 R18.2 71.02,28.78 70.87,28.63 v69.11,28.63 | v46.25,34.87 46.03,35.1 43.97,35.1 43.2,34.34 43.2,33.43 42.44,32.66 38.86,32.66 37.72,33.81 36.88,33.81 DISP1.10
N$9  (via drill 0.35)
  Top 0.203: DISP1.5 43.13,13.08 44.73,13.08 50.22,18.57 v50.6,18.57 50.67,18.57 52.12,20.02 v70.79,20.02
  Bottom 0.203: v50.6,18.57 54.56,18.57 R19.2 | v70.79,20.02 77.42,26.64 U$1.10
N$10
  Bottom 0.203: R23.2 68.2,39.37 68.2,38.46 77.5,29.16 79.25,29.16 81.31,27.1 81.31,25.42 87.63,19.1 U$1.5 87.55,6.3 85.14,3.89 40.67,3.89 36.88,7.67 36.88,11.86 DISP1.3
N$11
  Top 0.203: Q1.3 81.23,15.29 73.61,15.29 71.86,17.04 71.86,22.61 66.75,27.71 58.6,27.71 56.84,29.46 56.84,29.54 54.71,31.67 33.91,31.67 31.78,33.81 DISP1.12
N$12
  Top 0.203: Q2.3 42.37,35.56 41.91,35.1 40.61,35.1 DISP1.9
N$13
  Top 0.203: Q3.3 64.77,29.23 63.93,29.23 60.27,32.89 51.13,32.89 49.84,34.19 45.87,34.19 44.96,35.1 43.13,35.1 41.91,33.88 DISP1.8
N$14  (via drill 0.35)
  Top 0.203: v42.22,13.92 44.5,13.92 55.86,25.27 55.86,29.16 Q4.3
  Bottom 0.203: v42.22,13.92 42.37,13.92 44.42,11.86 DISP1.6
N$15
  Top 0.203: U$1.8 81.31,25.42 81.31,20.32 Q5.3 81.31,20.24 81.31,17.04 82.53,15.82 82.53,6.38 U$1.3
N$18  (via drill 0.35)
  Top 0.152: v27.2,32.97 27.2,34.49 31.24,38.53 v32,39.29
  Bottom 0.152: v32,39.29 36.04,39.29 U1.24 | v27.2,32.97 28.42,32.97 CONTROL.19
N$19  (via drill 0.35)
  Top 0.152: v30.56,31.6 30.56,37.13 31.95,38.53 v33.22,38.53
  Bottom 0.152: v33.22,38.53 33.53,38.84 36.04,38.84 U1.23 | v30.56,31.6 30.56,31.37 29.79,30.61 28.42,30.61 CONTROL.22
N$20  (via drill 0.35)
  Top 0.152: v25.45,34.19 v31.39,40.13
  Bottom 0.152: v31.39,40.13 36.81,40.13 U1.1 | v25.45,34.19 20.73,29.46 20.73,29.39 20.34,29.01 19.89,29.01 CONTROL.1
N$28
  Bottom 0.152: R13.1 62.25,25.04 64.47,25.04 68.2,28.78 68.2,31.22 67.21,32.21 67.21,40.06 67.06,40.21 52.5,40.21 43.66,31.37 41.76,31.37 39.32,28.93 IC1.21
N$29
  Bottom 0.152: R14.1 62.18,18.57 60.43,18.57 59.59,17.73 56.84,17.73 54.71,15.6 49.38,15.6 46.33,18.64 46.33,20.09 46.18,20.24 45.26,20.24 45.11,20.09 45.11,18.64 44.88,18.41 44.04,18.41 43.81,18.64 43.81,25.2 40.69,28.32 40.69,28.85 IC1.22
N$30
  Bottom 0.152: IC1.23 41.91,29.01 43.05,30.15 48.77,30.15 53.87,25.04 58.37,25.04 R15.1
N$31
  Bottom 0.152: R16.1 65.99,18.64 63.63,18.64 59.74,22.53 55.47,22.53 49.99,28.02 47.78,28.02 47.62,28.17 47.62,29.62 47.4,29.84 44.04,29.84 43.13,28.93 IC1.24
N$32  (via drill 0.35)
  Top 0.152: v46.18,27.1 v46.18,17.88
  Bottom 0.152: v46.18,17.88 48.77,15.29 54.86,15.29 56.46,16.89 58.37,16.89 R17.1 | v46.18,27.1 44.42,28.85 IC1.25
N$33  (via drill 0.35)
  Top 0.152: v68.81,24.74 58.14,24.74 55.7,22.3 v54.33,22.3
  Bottom 0.152: v68.81,24.74 71.09,27.03 R18.1 | v54.33,22.3 54.33,22.76 49.68,27.41 47.09,27.41 45.72,28.78 IC1.26
N$46
  Bottom 0.152: R19.1 54.64,16.97 54.64,17.27 55.4,18.03 55.4,22.15 49.84,27.71 47.62,27.71 47.02,28.32 47.02,28.85 IC1.27
N$47
  Bottom 0.152: R23.1 66.45,39.37 66.45,36.55 59.67,29.77 59.67,24.82 59.06,24.21 54.25,24.21 49.61,28.85 48.31,28.85 IC1.28
N$48  (via drill 0.35)
  Top 0.152: v53.57,14.07 v51.44,16.2
  Bottom 0.152: v51.44,16.2 48.31,19.33 IC1.1 | v53.57,14.07 78.79,14.07 81.84,17.12 82.53,17.12 Q1.2
N$49  (via drill 0.35)
  Top 0.152: v55.17,27.71 v51.82,24.36
  Bottom 0.152: v51.82,24.36 47.02,19.56 47.02,19.41 IC1.2 | v55.17,27.71 58.22,27.71 59.36,28.85 59.36,35.94 57.84,37.46 Q2.2
N$50  (via drill 0.35)
  Top 0.152: v72.7,17.12 72.7,25.96 67.59,31.06 66.06,31.06 Q3.2
  Bottom 0.152: IC1.3 45.72,18.34 45.57,18.19 45.57,17.58 48.16,14.99 70.56,14.99 v72.7,17.12
N$51
  Bottom 0.152: IC1.4 44.42,19.41 44.42,25.04 41.3,28.17 41.3,29.69 42.67,31.06 57.15,31.06 Q4.2
N$52
  Bottom 0.152: Q5.2 81.92,22.23 74.37,14.68 47.32,14.68 43.2,18.8 43.2,19.33 IC1.5
N$53
  Bottom 0.152: D1.K 12.27,42.34 35.59,42.34 37.34,40.59 37.34,40.21 U1.2
N$54
  Bottom 0.152: U1.3 37.8,40.21 37.8,40.66 35.81,42.65 18.29,42.65 16.54,44.4 D2.K
N$55
  Bottom 0.152: U1.4 38.33,40.21 38.33,40.66 36.04,42.95 24.31,42.95 22.86,44.4 D3.K
N$56
  Bottom 0.152: D4.K 30.4,43.26 36.2,43.26 38.79,40.66 38.79,40.21 U1.5
N$57
  Bottom 0.152: CAN_INTERFACE.1 16.31,12.09 18.59,12.09 18.9,12.39 18.9,19.48 16.54,21.84 CAN_SERIAL.1
N$58
  Bottom 0.152: CAN_SERIAL.2 15.24,16.89 16.23,15.9 CAN_INTERFACE.4
N$59
  Bottom 0.152: U1.6 39.32,40.21 39.32,40.66 35.59,44.4 D5.K
N$60
  Bottom 0.152: U1.7 40.16,39.37 40.16,42.65 41.91,44.4 D6.K
N$61
  Bottom 0.152: U1.8 40.16,38.91 42.75,38.91 48.23,44.4 D7.K
N$62
  Bottom 0.152: D8.K 53.42,43.26 52.05,43.26 47.17,38.38 40.16,38.38 U1.9
N$63
  Bottom 0.152: U1.10 40.16,37.92 47.17,37.92 52.2,42.95 54.33,42.95 54.64,43.26 59.82,43.26 60.96,44.4 D9.K
N$64  (via drill 0.35)
  Top 0.152: v48.46,40.59 v48.46,38.3 | v51.13,43.26 63.25,43.26 v63.55,43.56
  Bottom 0.152: v48.46,38.3 47.55,37.39 40.16,37.39 U1.11 | v51.13,43.26 v48.46,40.59 | v63.55,43.56 63.93,43.56 64.24,43.26 66.14,43.26 67.28,44.4 D10.K
N$65
  Bottom 0.152: D11.K 72.16,42.95 54.79,42.95 48.69,36.85 U1.12
N$66  (via drill 0.35)
  Top 0.152: v46.48,40.59 v42.06,36.17
  Bottom 0.152: v42.06,36.17 39.39,36.17 U1.13 | v46.48,40.59 51.51,45.62 78.87,45.62 80.01,44.48 D12.K
N$67  (via drill 0.35)
  Top 0.152: v31.5,37.31 38.02,37.31 42.37,41.66 58.67,41.66 v68.5,31.83
  Bottom 0.152: v31.5,37.31 36.04,37.31 U1.20 | v68.5,31.83 68.5,27.48 66.06,25.04 R24.1
OSC1
  Bottom 0.152: 8.12,14.41 6.4,12.7 Y1.2 | 8.12,14.41 9.75,16.05 10.13,16.05 C2.2 | CAN_SERIAL.8 7.62,20.55 5.26,18.19 5.26,17.27 8.12,14.41
OSC2
  Bottom 0.152: 8.91,17.73 6.4,17.73 Y1.1 | 8.91,17.73 9.91,17.73 11.51,16.13 12.65,16.13 C3.2 | 8.91,17.73 8.91,21.84 CAN_SERIAL.7
PARTY1  (via drill 0.35)
  Top 0.152: v22.17,34.27 27.2,29.23 27.2,25.96 v38.02,15.14
  Bottom 0.152: v22.17,34.27 22.17,36.02 CONTROL.10 | v38.02,15.14 38.02,7.06 39.24,5.84 69.49,5.84 71.25,7.59 PARTY1.2
PARTY2  (via drill 0.35)
  Top 0.152: v22.94,32.59 22.94,29.77 30.17,22.53 30.17,11.18 32.54,8.81 40.92,8.81 42.06,7.67 PARTY2.2
  Bottom 0.152: v22.94,32.59 22.94,36.02 CONTROL.11
RESET  (via drill 0.35)
  Top 0.152: v19.36,28.09 22.48,28.09 v23.01,28.63 | v15.85,6.15 14.02,7.98 R21.2
  Bottom 0.152: v19.36,28.09 18.59,28.09 15.24,31.45 CAN_SERIAL.17 | v23.01,28.63 23.7,27.94 23.7,27.48 CONTROL.29 23.77,27.41 23.77,16.13 27.89,12.01 27.89,7.67 PROGRAM.3 27.89,7.59 26.44,6.15 v15.85,6.15
RPADDLE  (via drill 0.35)
  Top 0.152: v27.81,27.41 30.02,27.41 42.82,14.6 v44.27,14.6
  Bottom 0.152: v27.81,27.41 26.97,27.41 CONTROL.25 | v44.27,14.6 48.39,10.49 48.39,7.67 RPADDLE.2
RX
  Bottom 0.152: CONTROL.30 22.94,27.41 22.94,16.51 26.59,12.85 26.59,7.14 25.91,6.45 24,6.45 22.86,7.59 PROGRAM.1
SCK
  Bottom 0.152: CONTROL.17 28.42,35.79 26.67,37.54 16.23,37.54 10.21,31.52 CAN_SERIAL.13
SS
  Bottom 0.152: CAN_SERIAL.16 14.02,31.52 19.43,36.93 24.92,36.93 25.3,36.55 25.3,36.09 CONTROL.14
T/S-TOOGLE  (via drill 0.35)
  Top 0.152: v40.92,9.42 61.87,9.42 T/S-TOOGLE.2
  Bottom 0.152: v40.92,9.42 40.69,9.65 40.69,13.39 38.33,15.75 37.8,15.75 34.9,18.64 34.9,20.09 32.54,22.45 28.42,22.45 26.14,24.74 26.14,27.41 CONTROL.26
TX
  Bottom 0.152: CONTROL.31 22.17,27.41 22.17,16.81 25.38,13.61 25.38,7.67 PROGRAM.2
VCC  (via drill 0.35)
  Top 0.406: 20.88,6.3 30.25,6.3 LPADDLE.1 31.7,7.52 32.69,7.52 33.91,6.3 37.87,6.3 PARTY2.1 | 20.88,6.3 17.91,6.3 14.48,9.73 14.02,9.73 R21.1 | 20.88,6.3 20.88,8.2 18.29,10.8 v18.29,12.7 18.36,12.85 18.36,34.87 18.75,35.26 v18.82,35.41 18.82,37.24 | C1.1 7.24,38.07 9.3,38.07 R20.2 9.45,38 10.21,37.24 18.82,37.24 | v26.67,33.73 26.06,33.73 25.76,33.43 25.15,33.43 21.34,37.24 18.82,37.24 | POWER.1 7.62,37.92 C1.1 | 7.62,43.1 7.62,38.23 C1.1 | 7.62,43.1 D1.A | 7.62,43.1 10.67,43.1 11.96,44.4 13.95,44.4 D2.A 14.17,44.48 15.47,45.77 17.07,45.77 18.36,44.48 20.27,44.48 D3.A 20.5,44.55 21.72,45.77 23.39,45.77 24.69,44.48 26.67,44.48 D4.A 26.82,44.32 28.04,43.1 29.72,43.1 31.01,44.4 33,44.4 | 33,44.4 D5.A 33.22,44.48 34.52,45.77 36.12,45.77 37.41,44.48 39.32,44.48 D6.A 39.55,44.55 40.77,45.77 42.44,45.77 43.74,44.48 45.72,44.48 D7.A 45.87,44.32 47.09,43.1 48.77,43.1 50.06,44.4 52.05,44.4 D8.A 52.27,44.48 53.57,45.77 55.17,45.77 56.46,44.48 58.37,44.48 D9.A 58.6,44.55 59.82,45.77 61.49,45.77 62.79,44.48 64.77,44.48 D10.A 64.92,44.32 66.14,43.1 67.82,43.1 69.11,44.4 71.09,44.4 D11.A 71.32,44.48 72.62,45.77 74.22,45.77 75.51,44.48 77.42,44.48 D12.A | v34.8,38.1 33,39.9 33,42.04 33.05,42.09 33.05,42.44 33,42.49 33,44.4
  Bottom 0.406: C6.1 12.19,19.1 12.19,19.41 12.65,19.86 13.87,19.86 14.78,18.95 14.78,15.9 16.08,14.6 CAN_INTERFACE.3 16.38,14.45 16.54,14.45 v18.29,12.7 | IC1.18 35.59,28.85 35.59,28.63 38.1,26.11 IC1.9 38.18,19.18 38.18,19.02 44.04,13.16 45.03,13.16 45.8,12.39 45.8,10.64 44.27,9.12 44.2,8.97 | 44.2,8.97 41.53,8.97 40.23,7.67 39.24,7.67 PARTY2.1 | 44.2,8.97 RPADDLE.1 45.72,7.52 46.94,6.3 49,6.3 50.29,7.59 53.11,7.59 LAUNCH.1 53.34,7.52 54.56,6.3 56.62,6.3 57.91,7.59 60.73,7.59 T/S-TOOGLE.1 60.96,7.52 62.18,6.3 64.24,6.3 65.53,7.59 68.35,7.59 PARTY1.1 | 18.82,31.45 19.74,31.45 19.81,31.37 CONTROL.4 | 18.82,31.45 16.54,31.45 CAN_SERIAL.18 | 19.13,32.89 19.81,32.89 CONTROL.6 | 19.13,32.89 18.82,32.59 18.82,31.45 | v26.67,33.73 28.42,33.73 CONTROL.18 | v18.82,35.41 18.82,33.27 19.05,33.05 19.13,32.89 | U1.21 35.05,37.85 v34.8,38.1
  pour Top: 0,49.53 0,0 93.98,0 93.98,49.53
(copper drawn outside any net)
  shapes: Top area x8